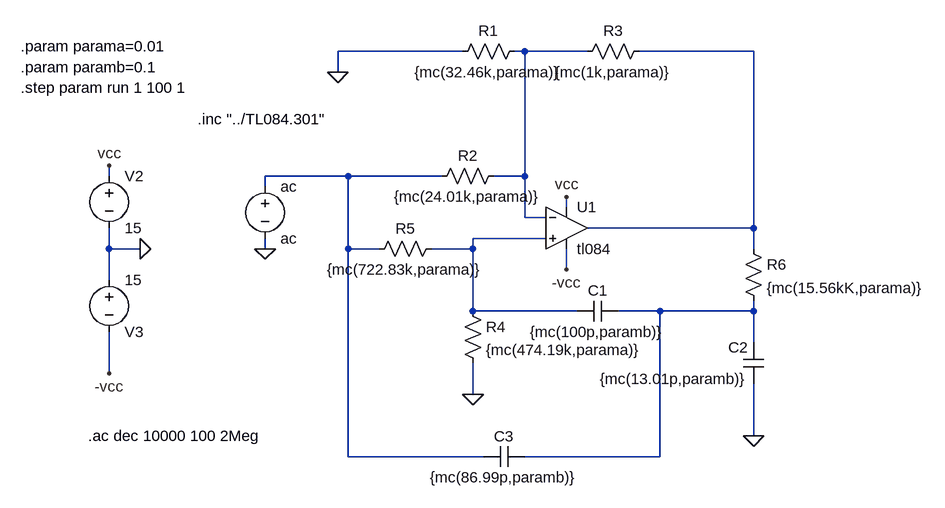
[diagram p0: schematic Celda Sedra sin pote.asc]
Celda Sedra sin pote.asc, the LTspice schematic file:
Version 4
SHEET 1 1092 680
WIRE 368 -160 176 -160
WIRE 464 -160 448 -160
WIRE 560 -160 464 -160
WIRE 816 -160 640 -160
WIRE 176 -128 176 -160
WIRE -176 32 -176 16
WIRE 192 32 64 32
WIRE 336 32 192 32
WIRE 464 32 464 -160
WIRE 464 32 416 32
WIRE 64 48 64 32
WIRE 528 80 528 64
WIRE 464 96 464 32
WIRE 496 96 464 96
WIRE 816 112 816 -160
WIRE 816 112 560 112
WIRE 496 128 384 128
WIRE -176 144 -176 112
WIRE -128 144 -176 144
WIRE 64 144 64 128
WIRE 192 144 192 32
WIRE 240 144 192 144
WIRE 384 144 384 128
WIRE 384 144 320 144
WIRE 816 144 816 112
WIRE 528 176 528 144
WIRE -176 192 -176 144
WIRE 384 240 384 144
WIRE 544 240 384 240
WIRE 672 240 608 240
WIRE 816 240 816 224
WIRE 816 240 672 240
WIRE 816 288 816 240
WIRE -176 336 -176 272
WIRE 384 368 384 320
WIRE 816 432 816 352
WIRE 192 464 192 144
WIRE 400 464 192 464
WIRE 672 464 672 240
WIRE 672 464 464 464
FLAG -128 144 0
FLAG -176 16 vcc
FLAG -176 336 -vcc
FLAG 528 64 vcc
FLAG 528 176 -vcc
FLAG 384 368 0
FLAG 176 -128 0
FLAG 816 432 0
FLAG 64 144 0
SYMBOL Opamps\\opamp2 528 48 R0
SYMATTR InstName U1
SYMATTR Value tl084
SYMBOL voltage -176 16 R0
WINDOW 123 0 0 Left 0
WINDOW 39 0 0 Left 0
SYMATTR InstName V2
SYMATTR Value 15
SYMBOL voltage -176 176 R0
WINDOW 0 24 96 Left 2
WINDOW 3 24 16 Left 2
WINDOW 123 0 0 Left 0
WINDOW 39 0 0 Left 0
SYMATTR InstName V3
SYMATTR Value 15
SYMBOL res 432 16 R90
WINDOW 0 0 56 VBottom 2
WINDOW 3 32 56 VTop 2
SYMATTR InstName R2
SYMATTR Value {mc(24.01k,parama)}
SYMBOL res 656 -176 R90
WINDOW 0 0 56 VBottom 2
WINDOW 3 32 56 VTop 2
SYMATTR InstName R3
SYMATTR Value {mc(1k,parama)}
SYMBOL res 464 -176 R90
WINDOW 0 0 56 VBottom 2
WINDOW 3 32 56 VTop 2
SYMATTR InstName R1
SYMATTR Value {mc(32.46k,parama)}
SYMBOL res 336 128 R90
WINDOW 0 0 56 VBottom 2
WINDOW 3 32 56 VTop 2
SYMATTR InstName R5
SYMATTR Value {mc(722.83k,parama)}
SYMBOL res 800 128 R0
SYMATTR InstName R6
SYMATTR Value {mc(15.56kK,parama)}
SYMBOL res 368 224 R0
SYMATTR InstName R4
SYMATTR Value {mc(474.19k,parama)}
SYMBOL cap 608 224 R90
WINDOW 0 0 32 VBottom 2
WINDOW 3 32 32 VTop 2
SYMATTR InstName C1
SYMATTR Value {mc(100p,paramb)}
SYMBOL cap 832 352 R180
WINDOW 0 24 56 Left 2
WINDOW 3 24 8 Left 2
SYMATTR InstName C2
SYMATTR Value {mc(13.01p,paramb)}
SYMBOL cap 400 480 R270
WINDOW 0 32 32 VTop 2
WINDOW 3 0 32 VBottom 2
SYMATTR InstName C3
SYMATTR Value {mc(86.99p,paramb)}
SYMBOL voltage 64 32 R0
WINDOW 123 0 0 Left 0
WINDOW 39 0 0 Left 0
SYMATTR InstName ac
SYMATTR Value ac
TEXT -208 432 Left 2 !.ac dec 10000 100 2Meg
TEXT -312 -168 Left 2 !.param parama=0.01
TEXT -312 -136 Left 2 !.param paramb=0.1
TEXT -312 -104 Left 2 !.step param run 1 100 1
TEXT -40 -56 Left 2 !.inc "../TL084.301"

The netlist it stands for:
* Celda Sedra sin pote.asc
XU1 N004 N001 vcc -vcc N002 tl084  ; pins In+ In- V+ V- OUT
V2 vcc 0 15
V3 0 -vcc 15
R2 N001 N003 {mc(24.01k,parama)}
R3 N002 N001 {mc(1k,parama)}
R1 N001 0 {mc(32.46k,parama)}
R5 N004 N003 {mc(722.83k,parama)}
R6 N002 N005 {mc(15.56kK,parama)}
R4 N004 0 {mc(474.19k,parama)}
C1 N005 N004 {mc(100p,paramb)}
C2 0 N005 {mc(13.01p,paramb)}
C3 N003 N005 {mc(86.99p,paramb)}
V§ac N003 0 ac
.ac dec 10000 100 2Meg
.param parama=0.01
.param paramb=0.1
.step param run 1 100 1
.inc "../TL084.301"
.backanno
.end